# EAGLE design Apex3 (EAGLE 9.2.1)

## Sheet 1 of 3
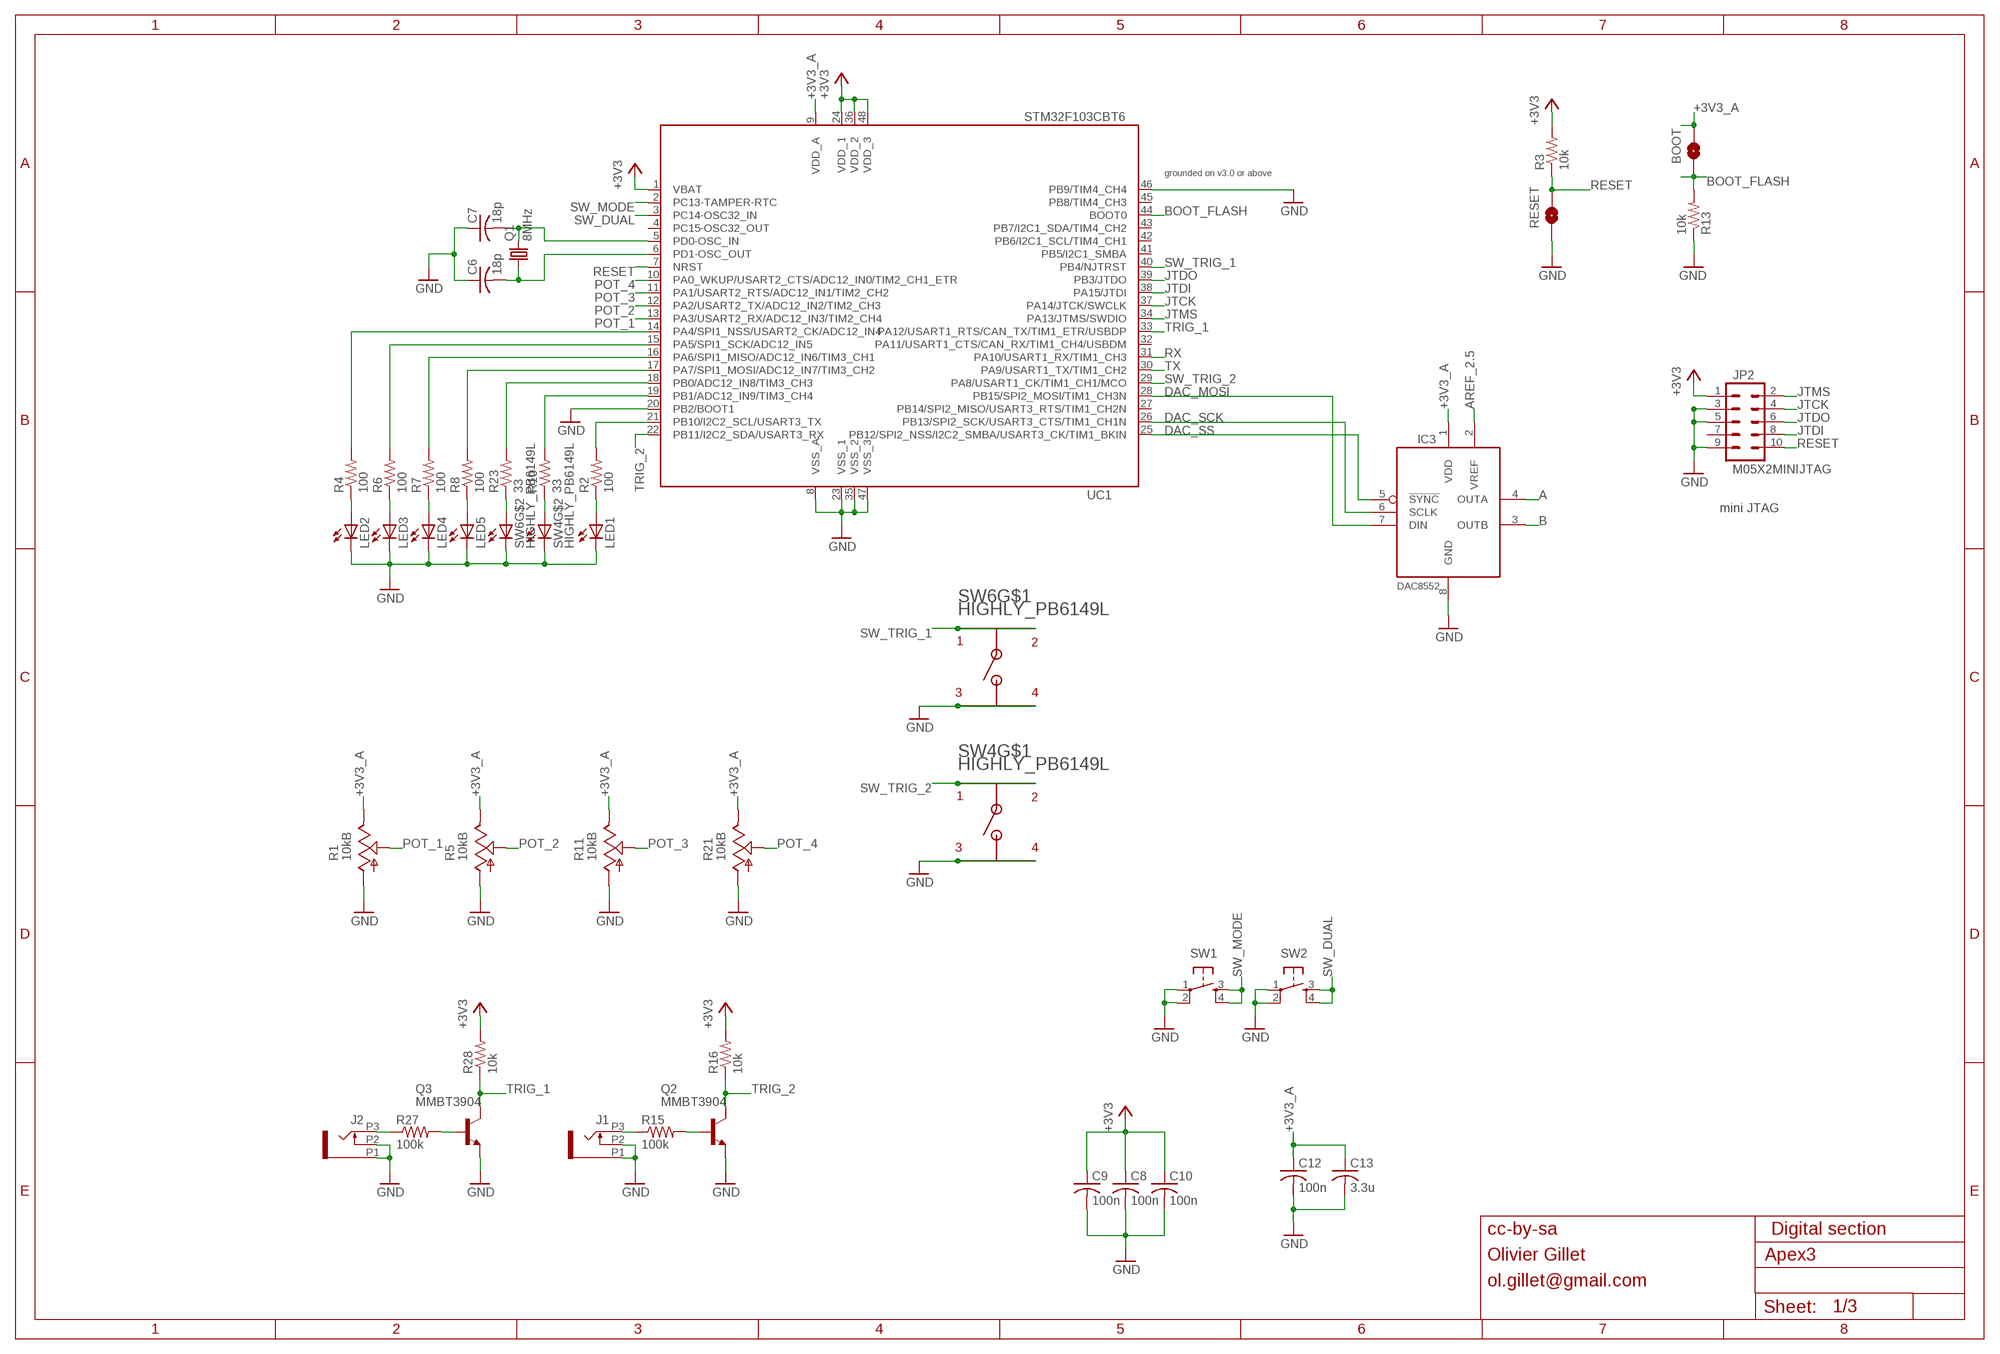
[diagram p0: schematic, sheet 1]

### Parts
BOOT  BOOT  JUMPER-SMT_2_NO_SILK  [SMT-JUMPER_2_NO_SILK]
C6  18p  C-USC0603  [C0603]
C7  18p  C-USC0603  [C0603]
C8  100n  C-USC0603  [C0603]
C9  100n  C-USC0603  [C0603]
C10  100n  C-USC0603  [C0603]
C12  100n  C-USC0603  [C0603]
C13  3.3u  C-USC0603  [C0603]
IC3  DAC8552  [MSOP-8]
J1  OG-PJ301_PJ301_THONKICONN  [OG-PJ301_WQP_PJ_301M6_NO_HOLE]
J2  OG-PJ301_PJ301_THONKICONN  [OG-PJ301_WQP_PJ_301M6_NO_HOLE]
JP2  M05X2MINIJTAG  [2X5-1.27]
LED1  LED3MM  [LED3MM]
LED2  LED3MM  [LED3MM]
LED3  LED3MM  [LED3MM]
LED4  LED3MM  [LED3MM]
LED5  LED3MM  [LED3MM]
Q1  8MHz  CRYSTALHC49UP  [HC49UP]
Q2  MMBT3904  MMBT3904LT1-NPN-SOT23-BEC  [SOT23-BEC]
Q3  MMBT3904  MMBT3904LT1-NPN-SOT23-BEC  [SOT23-BEC]
R1  10kB  POT-ALPS_POT_USVERTICAL  [POT-ALPS_ALPS_POT_VERTICAL]
R2  100  R-US_R0603  [R0603]
R3  10k  R-US_R0603  [R0603]
R4  100  R-US_R0603  [R0603]
R5  10kB  POT-ALPS_POT_USVERTICAL  [POT-ALPS_ALPS_POT_VERTICAL]
R6  100  R-US_R0603  [R0603]
R7  100  R-US_R0603  [R0603]
R8  100  R-US_R0603  [R0603]
R10  33  R-US_R0603  [R0603]
R11  10kB  POT-ALPS_POT_USVERTICAL  [POT-ALPS_ALPS_POT_VERTICAL]
R13  10k  R-US_R0603  [R0603]
R15  100k  R-US_R0603  [R0603]
R16  10k  R-US_R0603  [R0603]
R21  10kB  POT-ALPS_POT_USVERTICAL  [POT-ALPS_ALPS_POT_VERTICAL]
R23  33  R-US_R0603  [R0603]
R27  100k  R-US_R0603  [R0603]
R28  10k  R-US_R0603  [R0603]
RESET  RESET  JUMPER-SMT_2_NO_SILK  [SMT-JUMPER_2_NO_SILK]
SW1  TAC_SWITCHPTH  [TACTILE-PTH]
SW2  TAC_SWITCHPTH  [TACTILE-PTH]
SW4  HIGHLY_PB6149L  [HIGHLY_PB64149L]
SW6  HIGHLY_PB6149L  [HIGHLY_PB64149L]
UC1  STM32F103CBT6  STM32F103CB  [LQFP48]

### Nets
+3V3: C8.1 C9.1 C10.1 JP2.1 R3.2 R16.2 R28.2 UC1.1(VBAT) UC1.24(VDD_1) UC1.36(VDD_2) UC1.48(VDD_3) ; also sheet 3
+3V3_A: BOOT.2 C12.1 C13.1 IC3.1(VDD) R1.P$1(E) R5.P$1(E) R11.P$1(E) R21.P$1(E) UC1.9(VDD_A) ; also sheet 3
A: IC3.4(OUTA) ; also sheet 2
AREF_2.5: IC3.2(VREF) ; also sheet 3
B: IC3.3(OUTB) ; also sheet 2
BOOT_FLASH: BOOT.1 R13.2 UC1.44(BOOT0)
DAC_MOSI: IC3.7(DIN) UC1.28(PB15/SPI2_MOSI/TIM1_CH3N)
DAC_SCK: IC3.6(SCLK) UC1.26(PB13/SPI2_SCK/USART3_CTS/TIM1_CH1N)
DAC_SS: IC3.5(!SYNC) UC1.25(PB12/SPI2_NSS/I2C2_SMBA/USART3_CK/TIM1_BKIN)
GND: C6.1 C7.1 C8.2 C9.2 C10.2 C12.2 C13.2 IC3.8(GND) J1.P1 J1.P2 J2.P1 J2.P2 JP2.3 JP2.5 JP2.9 LED1.K(C) LED2.K(C) LED3.K(C) LED4.K(C) LED5.K(C) Q2.E Q3.E R1.P$3(A) R5.P$3(A) R11.P$3(A) R13.1 R21.P$3(A) RESET.1 SW1.1 SW1.2 SW2.1 SW2.2 SW4.L2 SW4.P$3 SW4.P$4 SW6.L2 SW6.P$3 SW6.P$4 UC1.8(VSS_A) UC1.20(PB2/BOOT1) UC1.23(VSS_1) UC1.35(VSS_2) UC1.46(PB9/TIM4_CH4) UC1.47(VSS_3) ; also sheet 2,3
JTCK: JP2.4 UC1.37(PA14/JTCK/SWCLK)
JTDI: JP2.8 UC1.38(PA15/JTDI)
JTDO: JP2.6 UC1.39(PB3/JTDO)
JTMS: JP2.2 UC1.34(PA13/JTMS/SWDIO)
N$1: J1.P3 R15.1
N$2: R23.2 UC1.18(PB0/ADC12_IN8/TIM3_CH3)
N$3: LED2.A R4.1
N$4: LED3.A R6.1
N$5: LED4.A R7.1
N$6: LED5.A R8.1
N$7: C7.2 Q1.2 UC1.5(PD0-OSC_IN)
N$8: C6.2 Q1.1 UC1.6(PD1-OSC_OUT)
N$9: R10.2 UC1.19(PB1/ADC12_IN9/TIM3_CH4)
N$10: R4.2 UC1.14(PA4/SPI1_NSS/USART2_CK/ADC12_IN4)
N$11: R6.2 UC1.15(PA5/SPI1_SCK/ADC12_IN5)
N$12: R7.2 UC1.16(PA6/SPI1_MISO/ADC12_IN6/TIM3_CH1)
N$13: R8.2 UC1.17(PA7/SPI1_MOSI/ADC12_IN7/TIM3_CH2)
N$14: Q2.B R15.2
N$16: R23.1 SW6.L1
N$17: R10.1 SW4.L1
N$18: LED1.A R2.1
N$19: R2.2 UC1.21(PB10/I2C2_SCL/USART3_TX)
N$57: J2.P3 R27.1
N$66: Q3.B R27.2
POT_1: R1.P$2(S) UC1.13(PA3/USART2_RX/ADC12_IN3/TIM2_CH4)
POT_2: R5.P$2(S) UC1.12(PA2/USART2_TX/ADC12_IN2/TIM2_CH3)
POT_3: R11.P$2(S) UC1.11(PA1/USART2_RTS/ADC12_IN1/TIM2_CH2)
POT_4: R21.P$2(S) UC1.10(PA0_WKUP/USART2_CTS/ADC12_IN0/TIM2_CH1_ETR)
RESET: JP2.10 R3.1 RESET.2 UC1.7(NRST)
RX: UC1.31(PA10/USART1_RX/TIM1_CH3)
SW_DUAL: SW2.3 SW2.4 UC1.3(PC14-OSC32_IN)
SW_MODE: SW1.3 SW1.4 UC1.2(PC13-TAMPER-RTC)
SW_TRIG_1: SW6.P$1 SW6.P$2 UC1.40(PB4/NJTRST)
SW_TRIG_2: SW4.P$1 SW4.P$2 UC1.29(PA8/USART1_CK/TIM1_CH1/MCO)
TRIG_1: Q3.C R28.1 UC1.33(PA12/USART1_RTS/CAN_TX/TIM1_ETR/USBDP)
TRIG_2: Q2.C R16.1 UC1.22(PB11/I2C2_SDA/USART3_RX)
TX: UC1.30(PA9/USART1_TX/TIM1_CH2)
Unconnected: JP2.7 UC1.4(PC15-OSC32_OUT) UC1.27(PB14/SPI2_MISO/USART3_RTS/TIM1_CH2N) UC1.32(PA11/USART1_CTS/CAN_RX/TIM1_CH4/USBDM) UC1.41(PB5/I2C1_SMBA) UC1.42(PB6/I2C1_SCL/TIM4_CH1) UC1.43(PB7/I2C1_SDA/TIM4_CH2) UC1.45(PB8/TIM4_CH3)

### Notes on the sheet
- grounded on v3.0 or above
- mini JTAG
- cc-by-sa | Digital section
- Olivier Gillet
- ol.gillet@gmail.com

## Sheet 2 of 3
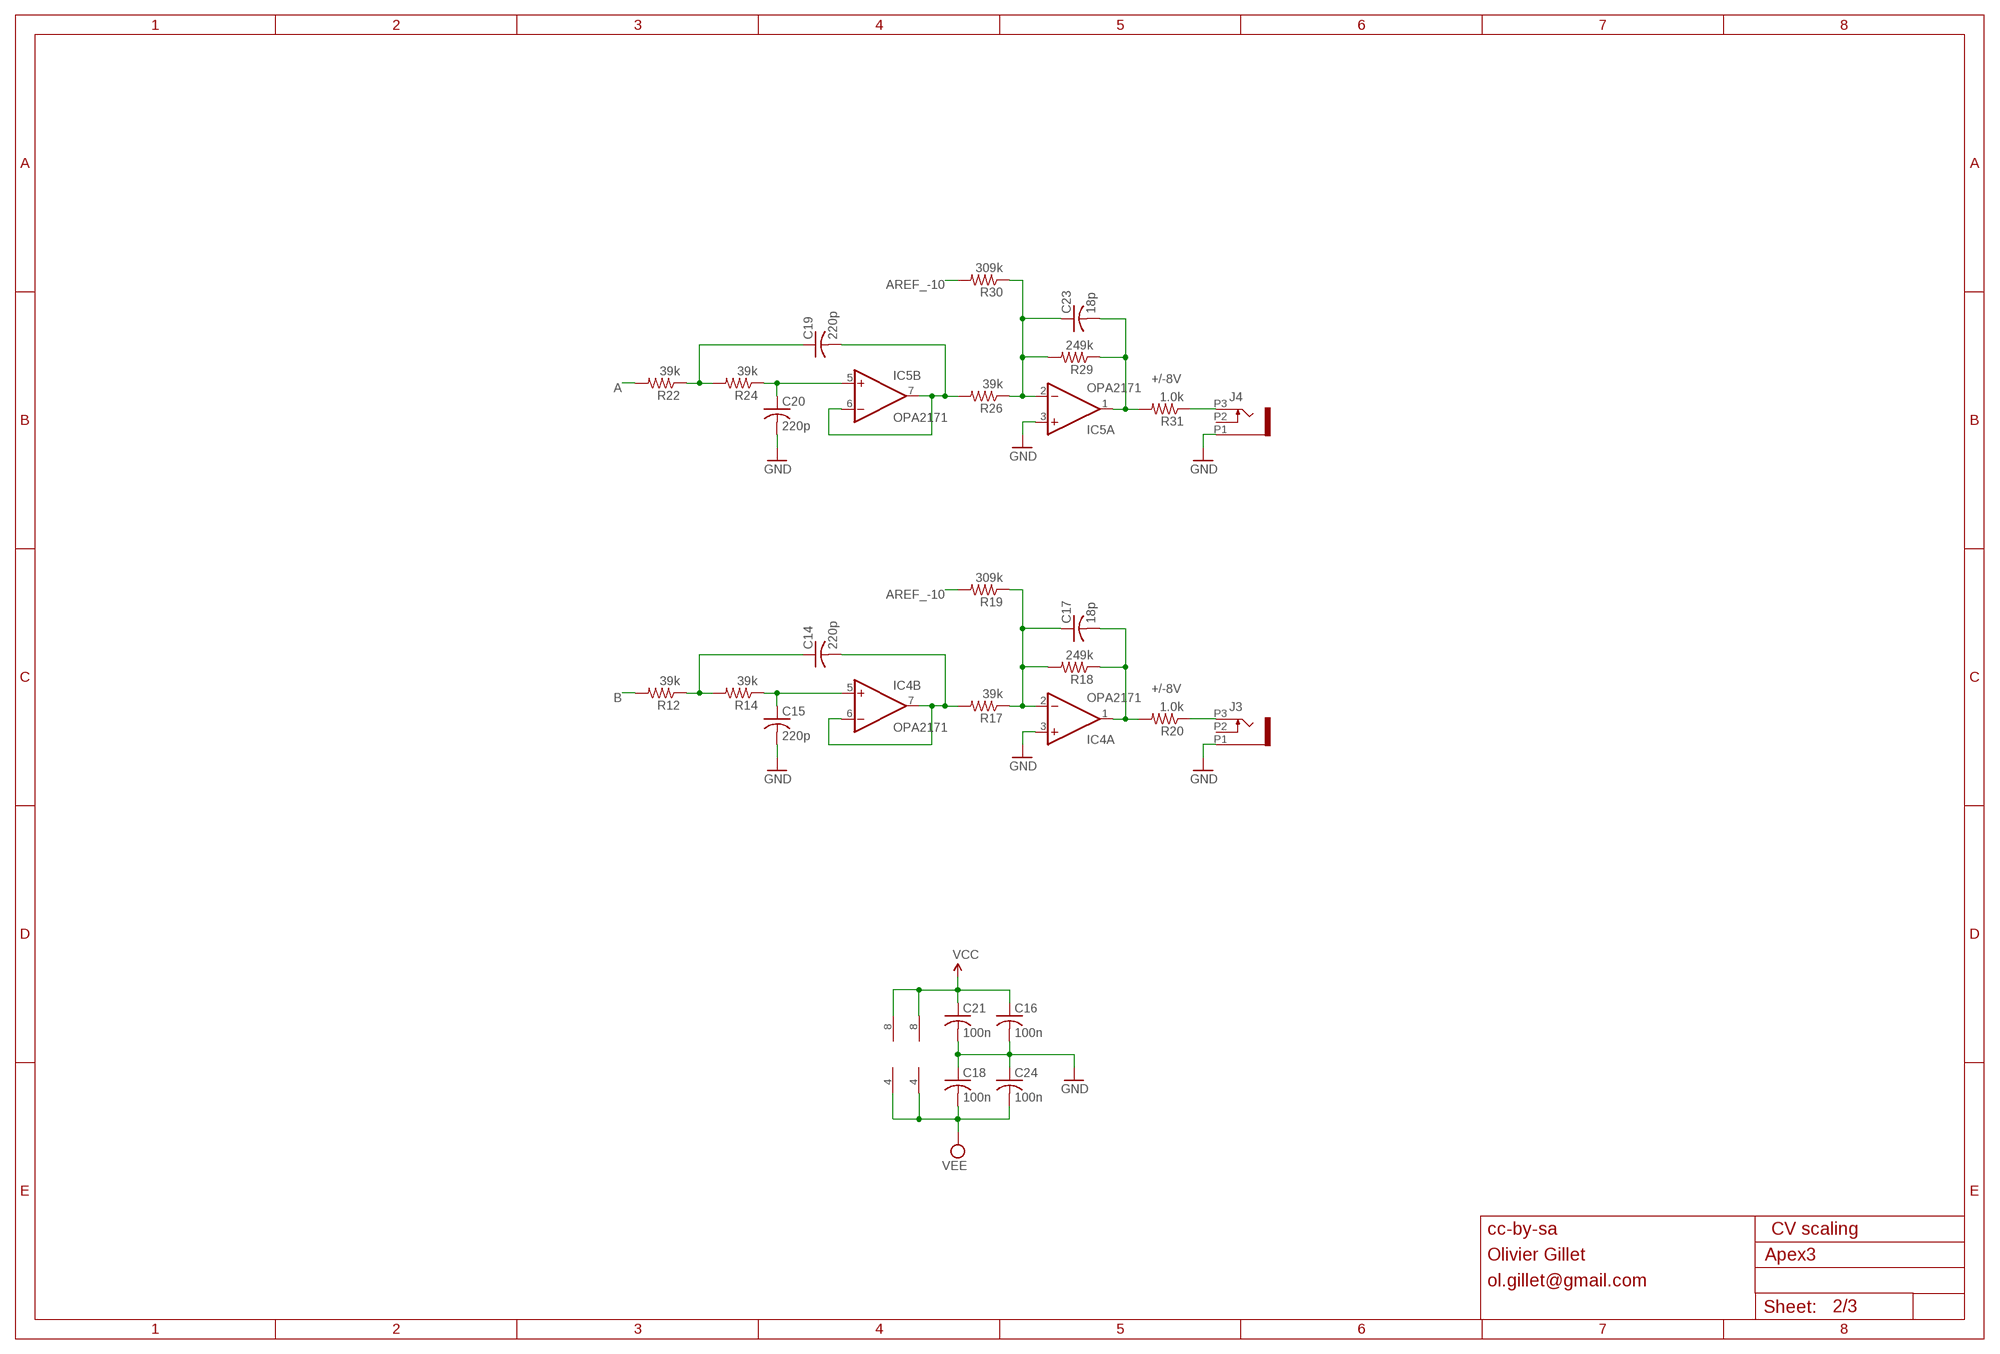
[diagram p1: schematic, sheet 2]

### Parts
C14  220p  C-USC0603  [C0603]
C15  220p  C-USC0603  [C0603]
C16  100n  C-USC0603  [C0603]
C17  18p  C-USC0603  [C0603]
C18  100n  C-USC0603  [C0603]
C19  220p  C-USC0603  [C0603]
C20  220p  C-USC0603  [C0603]
C21  100n  C-USC0603  [C0603]
C23  18p  C-USC0603  [C0603]
C24  100n  C-USC0603  [C0603]
IC4  OPA2171  TL072D  [SO08]
IC5  OPA2171  TL072D  [SO08]
J3  OG-PJ301_PJ301_THONKICONN  [OG-PJ301_WQP_PJ_301M6_NO_HOLE]
J4  OG-PJ301_PJ301_THONKICONN  [OG-PJ301_WQP_PJ_301M6_NO_HOLE]
R12  39k  R-US_R0603  [R0603]
R14  39k  R-US_R0603  [R0603]
R17  39k  R-US_R0603  [R0603]
R18  249k  R-US_R0603  [R0603]
R19  309k  R-US_R0603  [R0603]
R20  1.0k  R-US_R0603  [R0603]
R22  39k  R-US_R0603  [R0603]
R24  39k  R-US_R0603  [R0603]
R26  39k  R-US_R0603  [R0603]
R29  249k  R-US_R0603  [R0603]
R30  309k  R-US_R0603  [R0603]
R31  1.0k  R-US_R0603  [R0603]

### Nets
A: R22.2 ; also sheet 1
AREF_-10: R19.2 R30.2 ; also sheet 3
B: R12.2 ; also sheet 1
BI_OUT: C17.2 IC4.1(A:OUT) R18.1 R20.2
BI_OUT1: C23.2 IC5.1(A:OUT) R29.1 R31.2
F_CV: C17.1 IC4.2(A:-IN) R17.1 R18.2 R19.1
F_CV1: C23.1 IC5.2(A:-IN) R26.1 R29.2 R30.1
GND: C15.2 C16.2 C18.1 C20.2 C21.2 C24.1 IC4.3(A:+IN) IC5.3(A:+IN) J3.P1 J4.P1 ; also sheet 1,3
N$15: C19.2 IC5.6(B:-IN) IC5.7(B:OUT) R26.2
N$20: C20.1 IC5.5(B:+IN) R24.1
N$21: C19.1 R22.1 R24.2
N$22: J3.P3 R20.1
N$24: J4.P3 R31.1
N$42: C14.2 IC4.6(B:-IN) IC4.7(B:OUT) R17.2
N$43: C15.1 IC4.5(B:+IN) R14.1
N$45: C14.1 R12.1 R14.2
VCC: C16.1 C21.1 IC4.8(P:V+) IC5.8(P:V+) ; also sheet 3
VEE: C18.2 C24.2 IC4.4(P:V-) IC5.4(P:V-) ; also sheet 3
Unconnected: J3.P2 J4.P2

### Notes on the sheet
- +/-8V
- +/-8V
- cc-by-sa | CV scaling
- Olivier Gillet
- ol.gillet@gmail.com

## Sheet 3 of 3
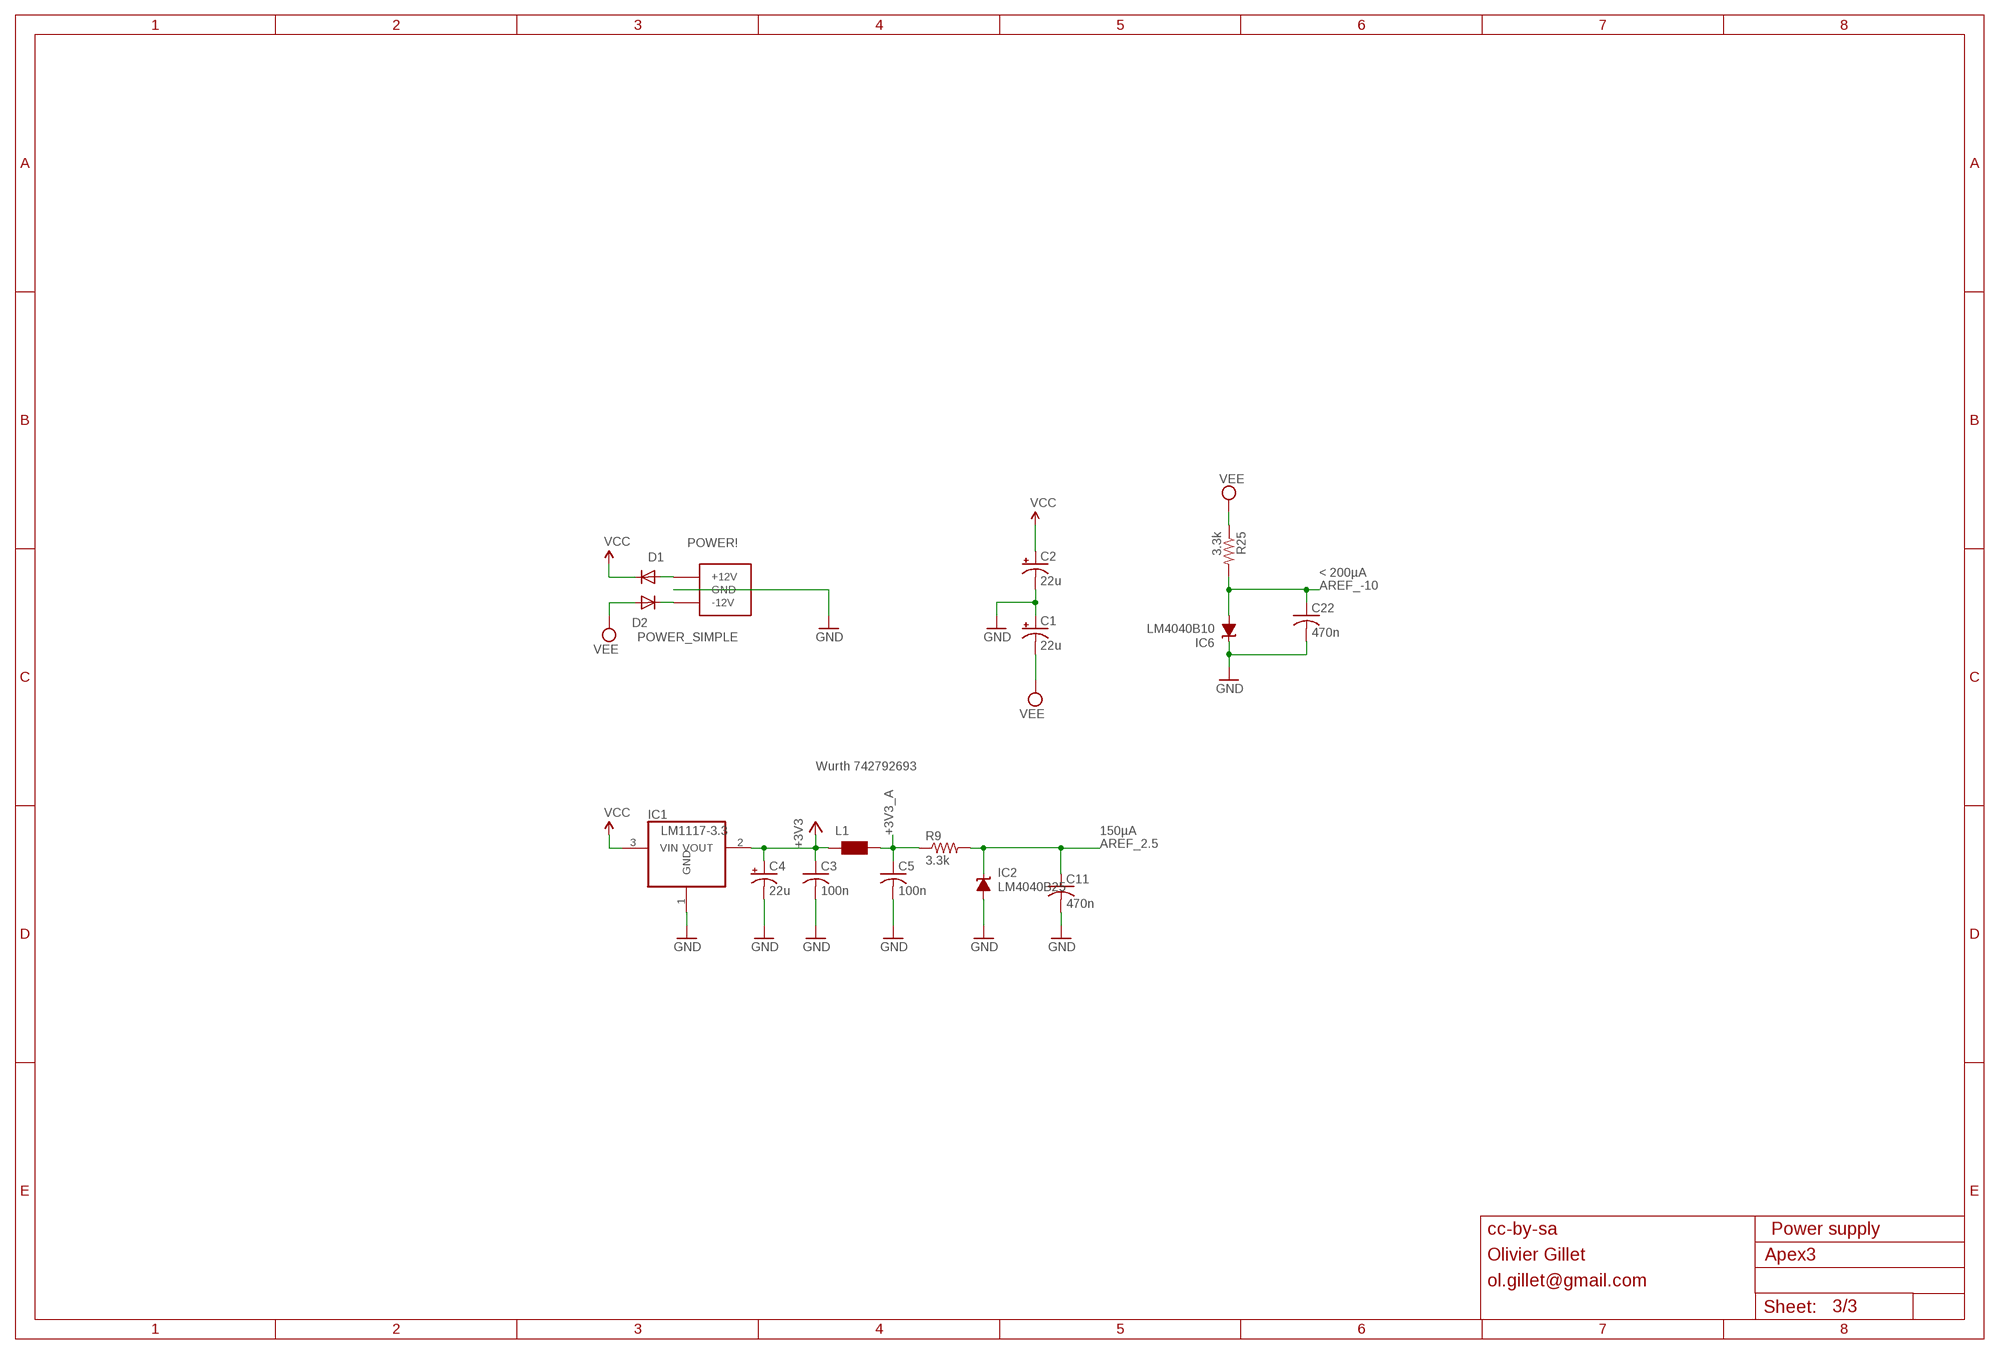
[diagram p2: schematic, sheet 3]

### Parts
C1  22u  CPOL-USC  [PANASONIC_C]
C2  22u  CPOL-USC  [PANASONIC_C]
C3  100n  C-USC0603  [C0603]
C4  22u  CPOL-USC  [PANASONIC_C]
C5  100n  C-USC0603  [C0603]
C11  470n  C-USC0603  [C0603]
C22  470n  C-USC0603  [C0603]
D1  1N5819HW  DIODE-SOD123  [SOD123]
D2  1N5819HW  DIODE-SOD123  [SOD123]
IC1  LM1117-3.3  REG1117  [SOT223]
IC2  LM4040B25  LM4041B12DBZ  [DBZ_R-PDSO-G3]
IC6  LM4040B10  LM4041B12DBZ  [DBZ_R-PDSO-G3]
L1  WE-CBF_0603  [0603]
POWER!  POWER_SIMPLE  [2X05_SMT_HEADER]
R9  3.3k  R-US_R0603  [R0603]
R25  3.3k  R-US_R0603  [R0603]

### Nets
+3V3: C3.1 C4.+ IC1.2(VOUT) L1.1 ; also sheet 1
+3V3_A: C5.1 L1.2 R9.1 ; also sheet 1
AREF_2.5: C11.1 IC2.1(C) R9.2 ; also sheet 1
AREF_-10: C22.1 IC6.2(A) R25.2 ; also sheet 2
GND: C1.+ C2.- C3.2 C4.- C5.2 C11.2 C22.2 IC1.1(GND) IC2.2(A) IC6.1(C) POWER!.3(GND) POWER!.4(GND) POWER!.5(GND) POWER!.6(GND) POWER!.7(GND) POWER!.8(GND) ; also sheet 1,2
N$23: D1.A POWER!.9(+12V) POWER!.10(+12V)
N$25: D2.C POWER!.1(-12V) POWER!.2(-12V)
VCC: C2.+ D1.C IC1.3(VIN) ; also sheet 2
VEE: C1.- D2.A R25.1 ; also sheet 2

### Notes on the sheet
- < 200µA
- Wurth 742792693
- 150µA
- cc-by-sa | Power supply
- Olivier Gillet
- ol.gillet@gmail.com

## Library data of the parts
BOOT RESET = SparkFun-Jumpers:JUMPER-SMT_2_NO: Normally open jumper This jumper has two pads in close proximity to each other. Apply solder to close the connection. Round pads are easier to solder for beginners, but are a lot larger. SparkFun Product that uses the round pads: SparkFun EL Sequencer <https://www.sparkfun.com/products/12781>
C1 C2 C4 = rcl:CPOL-US: POLARIZED CAPACITOR, American symbol
C3 C5-C24 = rcl:C-US: CAPACITOR, American symbol
D1 D2 = diode:DIODE-: DIODE
IC1 = og-vreg:REG1117: 800mA and 1A Low Dropout (LDO) Positive Regulator 1.8V, 2.5V, 2.85V, 3.3V, 5V, and Adj
IC2 IC6 = texas:LM4041: PRECISION MICROPOWER SHUNT VOLTAGE REFERENCE Source: http://focus.ti.com/lit/ds/slcs146e/slcs146e.pdf
IC3 = og-dac:DAC8552
IC4 IC5 = linear:TL072: OP AMP
J1-J4 = SHAY_THONKICONNS:OG-PJ301_PJ301_THONKICONN
JP2 = og-header:M05X2: Header 5x2 Standard 10-pin dual row 0.1" header. Commonly used with AVR-ISP. Use with Spark Fun Electronics SKU: PRT-00778
L1 = wuerth-elektronik:WE-CBF: SMD EMI Suppression Ferrite Beads - excellent anti-EMI properties - low DCR - impedances till 3000 ohms - rated current up to 6 A
LED1-LED5 = led:LED: LED OSRAM: - CHIPLED LG R971, LG N971, LY N971, LG Q971, LY Q971, LO R971, LY R971 LH N974, LH R974 LS Q976, LO Q976, LY Q976 LO Q996 - Hyper CHIPLED LW Q18S LB Q993, LB Q99A, LB R99A - SideLED LS A670, LO A670, LY A670, LG A670, LP A670 LB A673, LV A673, LT A673, LW A673 LH A674 LY A675 LS A676, LA A676, LO A676, LY A676, LW A676 LS A679, LY A679, LG A679 - Hyper Micro SIDELED® LS Y876, LA Y876, LO Y876, LY Y876 LT Y87S - SmartLED LW L88C, LW L88S LB L89C, LB L89S, LG L890 LS L89K, LO L89K, LY L89K LS L896, LA L896, LO L896, LY L896 - TOPLED LS T670, LO T670, LY T670, LG T670, LP T670 LSG T670, LSP T670, LSY T670, LOP T670, LYG T670 LG T671, LOG T671, LSG T671 LB T673, LV T673, LT T673, LW T673 LH T674 LS T676, LA T676, LO T676, LY T676, LB T676, LH T676, LSB T676, LW T676 LB T67C, LV T67C, LT T67C, LS T67K, LO T67K, LY T67K, LW E67C LS E67B, LA E67B, LO E67B, LY E67B, LB E67C, LV E67C, LT E67C LW T67C LS T679, LY T679, LG T679 LS T770, LO T770, LY T770, LG T770, LP T770 LB T773, LV T773, LT T773, LW T773 LH T774 LS E675, LA E675, LY E675, LS T675 LS T776, LA T776, LO T776, LY T776, LB T776 LHGB T686 LT T68C, LB T68C - Hyper Mini TOPLED® LB M676 - Mini TOPLED Santana® LG M470 LS M47K, LO M47K, LY M47K Source: http://www.osram.convergy.de LUXEON: - LUMILED® LXK2-PW12-R00, LXK2-PW12-S00, LXK2-PW14-U00, LXK2-PW14-V00 LXK2-PM12-R00, LXK2-PM12-S00, LXK2-PM14-U00 LXK2-PE12-Q00, LXK2-PE12-R00, LXK2-PE12-S00, LXK2-PE14-T00, LXK2-PE14-U00 LXK2-PB12-K00, LXK2-PB12-L00, LXK2-PB12-M00, LXK2-PB14-N00, LXK2-PB14-P00, LXK2-PB14-Q00 LXK2-PR12-L00, LXK2-PR12-M00, LXK2-PR14-Q00, LXK2-PR14-R00 LXK2-PD12-Q00, LXK2-PD12-R00, LXK2-PD12-S00 LXK2-PH12-R00, LXK2-PH12-S00 LXK2-PL12-P00, LXK2-PL12-Q00, LXK2-PL12-R00 Source: www.luxeon.com KINGBRIGHT: KA-3528ASYC Source: www.kingbright.com
POWER! = EurorackModularParts:POWER_SIMPLE
Q1 = crystal:CRYSTAL: CRYSTAL
Q2 Q3 = transistor:*-NPN-: NPN Transistror BF959 corrected 2008.03.06
R1 R5 R11 R21 = braids_v50:POT-ALPS_POT_US
R2-R4 R6-R10 R12-R20 R22-R31 = rcl:R-US_: RESISTOR, American symbol
SW1 SW2 = SparkFun:TAC_SWITCH: Momentary Switch Button commonly used for reset or general input. Spark Fun Electronics SKU : COM-00097
SW4 SW6 = HIGHLY PB6149L:HIGHLY_PB6149L
UC1 = stm32:STM32F103CB

## Board
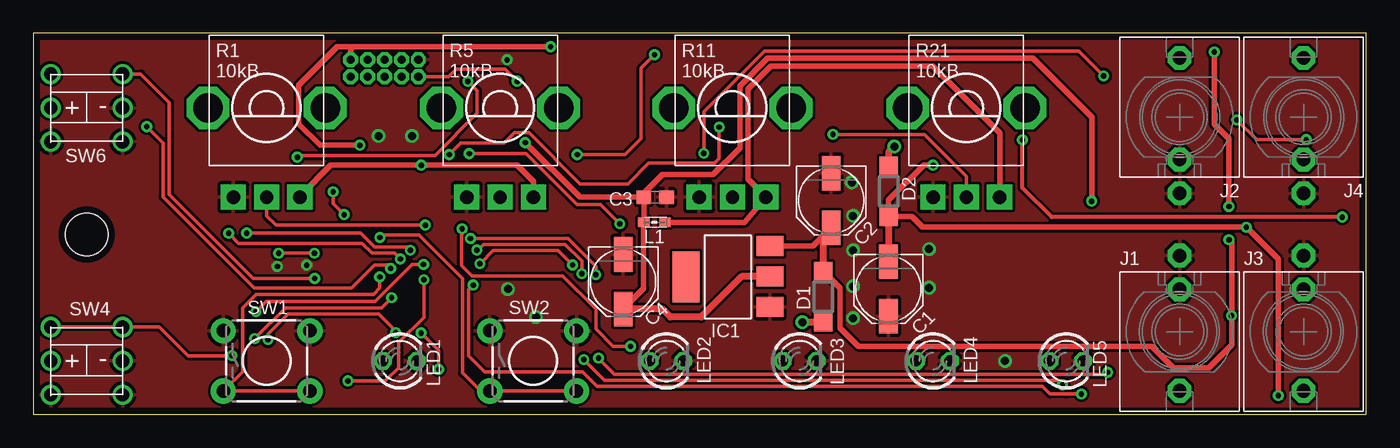
[diagram p3: board, top side]
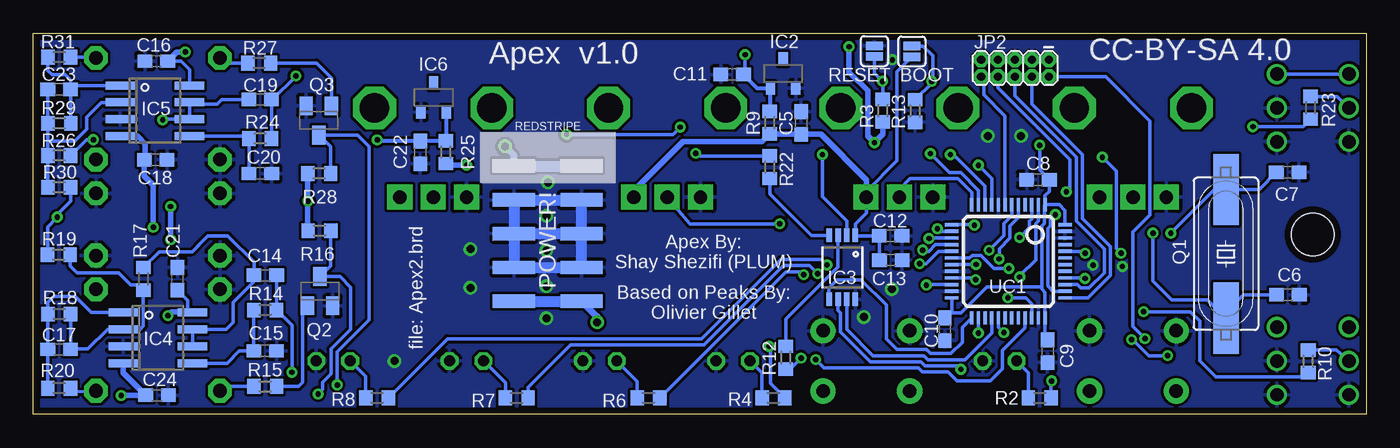
[diagram p4: board, bottom side, seen from below]

Size 100 x 28.6 mm. Coordinates in mm from the lower left corner, seen from the top.
Outline: 0,0 100,0 100,28.6 0,28.6 0,0
Copper layers (1*16): Top 0.035mm / dielectric 1.5mm / Bottom 0.035mm
Design rules "default *": minimum track width 8mil, minimum drill 0.4mm, track to track 8mil, track to pad 6mil, pad to pad 6mil, via to via 6mil, smd to smd 6mil, copper to edge 20mil, drill to drill 6mil, minimum pad ring 10mil, minimum via ring 8mil, stop-mask expansion 4mil, vias tented up to drill 25mil, thermal gap 10mil
Holes 3.2 mm at 4,13.5

### Footprints (pad centres in the part's own frame; a part is rotated, then mirrored left to right if it is on the bottom)
SMT-JUMPER_2_NO_SILK = smd 0.635 x 1.27: 1 -0.406,0; 2 0.406,0
PANASONIC_C = smd 2.6 x 1.4: + 2.05,0; - -2.05,0
C0603 = smd 1.1 x 1: 1 -0.85,0; 2 0.85,0
SOD123 = smd 1.4 x 1.4: A 1.9,0; C -1.9,0
SOT223 = smd 1.499 x 2.007: 1 -2.261,-3.15; 2 0.025,-3.15; 3 2.311,-3.15 | smd 3.81 x 2.007: 4 0,3.15
DBZ_R-PDSO-G3 = smd 0.7 x 1: 1 -0.95,-1.1; 2 0.95,-1.1; 3 0,1.1
MSOP-8 = smd 0.41 x 1.02: 1 -0.975,-2.4; 2 -0.325,-2.4; 3 0.325,-2.4; 4 0.975,-2.4; 5 0.975,2.4; 6 0.325,2.4; 7 -0.325,2.4; 8 -0.975,2.4
SO08 = smd 0.6 x 2.2: 1 -1.905,-2.6; 2 -0.635,-2.6; 3 0.635,-2.6; 4 1.905,-2.6; 5 1.905,2.6; 6 0.635,2.6; 7 -0.635,2.6; 8 -1.905,2.6
OG-PJ301_WQP_PJ_301M6_NO_HOLE = drill 1.016 pad 1.778 octagon: P1 0,-5.715; P2 0,-3.175; P3 0,4.445
2X5-1.27 = drill 0.61 pad 1.067 octagon: 1 -1.27,3.81; 2 0,3.81; 3 -1.27,2.54; 4 0,2.54; 5 -1.27,1.27; 6 0,1.27; 7 -1.27,0; 8 0,0; 9 -1.27,-1.27; 10 0,-1.27
0603 = smd 0.85 x 0.7: 1 -0.9,0; 2 0.7,0
LED3MM = drill 0.813 octagon: A -1.27,0; K 1.27,0
2X05_SMT_HEADER = smd 1 x 3.17: 1 -5.08,-2.54; 2 -5.08,2.54; 3 -2.54,-2.54; 4 -2.54,2.54; 5 0,-2.54; 6 0,2.54; 7 2.54,-2.54; 8 2.54,2.54; 9 5.08,-2.54; 10 5.08,2.54
HC49UP = smd 5.334 x 1.93: 1 -4.826,0; 2 4.826,0
SOT23-BEC = smd 1 x 1.4: B -0.95,-1.1; C 0,1.1; E 0.95,-1.1
POT-ALPS_ALPS_POT_VERTICAL = drill 1 pad 1.88 square: P$1 -2.5,6.7; P$2 0,6.7; P$3 2.5,6.7 | drill 2.2 pad 3.175 octagon: P$4 -4.4,0; P$5 4.4,0
R0603 = smd 1 x 1.1: 1 -0.85,0; 2 0.85,0
TACTILE-PTH = drill 1.016 pad 1.88: 1 -3.251,2.261; 2 3.251,2.261; 3 -3.251,-2.261; 4 3.251,-2.261
HIGHLY_PB64149L = drill 1: L1 0,-2.7; L2 0,2.7; P$1 -2.54,-2.7; P$2 -2.54,2.7; P$3 2.54,-2.7; P$4 2.54,2.7
LQFP48 = smd 0.254 x 1: 1 -2.75,-4.25; 2 -2.25,-4.25; 3 -1.75,-4.25; 4 -1.25,-4.25; 5 -0.75,-4.25; 6 -0.25,-4.25; 7 0.25,-4.25; 8 0.75,-4.25; 9 1.25,-4.25; 10 1.75,-4.25; 11 2.25,-4.25; 12 2.75,-4.25; 25 2.75,4.25; 26 2.25,4.25; 27 1.75,4.25; 28 1.25,4.25; 29 0.75,4.25; 30 0.25,4.25; 31 -0.25,4.25; 32 -0.75,4.25; 33 -1.25,4.25; 34 -1.75,4.25; 35 -2.25,4.25; 36 -2.75,4.25 | smd 1 x 0.254: 13 4.25,-2.75; 14 4.25,-2.25; 15 4.25,-1.75; 16 4.25,-1.25; 17 4.25,-0.75; 18 4.25,-0.25; 19 4.25,0.25; 20 4.25,0.75; 21 4.25,1.25; 22 4.25,1.75; 23 4.25,2.25; 24 4.25,2.75; 37 -4.25,2.75; 38 -4.25,2.25; 39 -4.25,1.75; 40 -4.25,1.25; 41 -4.25,0.75; 42 -4.25,0.25; 43 -4.25,-0.25; 44 -4.25,-0.75; 45 -4.25,-1.25; 46 -4.25,-1.75; 47 -4.25,-2.25; 48 -4.25,-2.75

### Placement (x,y rotation side)
BOOT  34.09,27.24 270 bottom
C1  64.15,9.41 270 top
C2  59.86,16.05 270 top
C3  46.66,16.29 0 top
C4  44.25,9.95 270 top
C5  42.39,21.87 90 bottom
C6  5.87,8.97 180 bottom
C7  5.89,18.17 180 bottom
C8  24.62,17.61 180 bottom
C9  23.91,4.73 270 bottom
C10  31.61,6.38 270 bottom
C11  47.57,25.51 180 bottom
C12  35.68,13.39 0 bottom
C13  35.67,11.57 0 bottom
C14  82.59,10.43 180 bottom
C15  82.61,4.76 0 bottom
C16  90.77,26.51 180 bottom
C17  98.07,4.87 180 bottom
C18  90.82,19.11 180 bottom
C19  82.98,23.63 180 bottom
C20  82.97,18.07 0 bottom
C21  89.18,10.17 90 bottom
C22  70.97,19.66 270 bottom
C23  98.07,24.39 0 bottom
C24  90.72,1.43 180 bottom
D1  59.27,8.83 270 top
D2  64.17,16.73 270 top
IC1  52.11,10.31 90 top
IC2  43.74,25.58 0 bottom
IC3  39.3,11.03 180 bottom
IC4  90.65,5.74 270 bottom
IC5  90.88,22.78 270 bottom
IC6  69.97,23.78 0 bottom
J1  86,6.2 180 top
J2  86,22.3 0 top
J3  95.3,6.2 180 top
J4  95.3,22.3 0 top
JP2  27.62,25.35 270 bottom
L1  46.69,14.41 0 top
LED1  27.5,4 0 top
LED2  47.5,4 0 top
LED3  57.5,4 0 top
LED4  67.5,4 0 top
LED5  77.5,4 0 top
POWER!  61.41,13.56 270 bottom
Q1  10.52,12.04 90 bottom
Q2  78.49,9.24 0 bottom
Q3  78.58,22.06 180 bottom
R1  17.5,23 180 top
R2  24.49,1.23 0 bottom
R3  36.27,22.79 270 bottom
R4  44.47,1.23 0 bottom
R5  35.02,23 180 top
R6  53.85,1.23 0 bottom
R7  63.73,1.23 0 bottom
R8  74.21,1.23 0 bottom
R9  44.75,21.89 90 bottom
R10  4.35,3.97 270 bottom
R11  52.45,23 180 top
R12  43.55,4.25 90 bottom
R13  33.85,22.77 90 bottom
R14  82.61,7.82 0 bottom
R15  82.59,2.09 0 bottom
R16  78.53,13.78 180 bottom
R17  91.75,10.17 90 bottom
R18  98.06,7.52 0 bottom
R19  98.08,11.97 180 bottom
R20  98.07,1.95 180 bottom
R21  70,23 180 top
R22  44.75,18.55 270 bottom
R23  4.17,23.01 270 bottom
R24  82.98,20.7 0 bottom
R25  69.05,19.67 90 bottom
R26  98.05,19.42 0 bottom
R27  83.05,26.36 0 bottom
R28  78.55,18.07 180 bottom
R29  98.04,21.83 180 bottom
R30  98.06,17.04 0 bottom
R31  98.06,26.81 180 bottom
RESET  36.9,27.26 270 bottom
SW1  17.5,4 0 top
SW2  37.5,4 0 top
SW4  4,4 270 top
SW6  4,23 270 top
UC1  26.84,11.48 180 bottom

### Tracks (layer width: path | path; a pad name or v marks a point on that pad's centre or on a via)
+3V3  (via drill 0.4)
  Top 0.254: JP2.1
  Top 0.305: L1.1 45.81,14.43
  Top 0.406: C4.+ 45.79,9.44 L1.1 | 45.81,14.43 C3.1 | C3.1 41.01,16.29 v36.9,20.4 | C3.1 45.81,16.61 47.2,18 51.01,18 53,19.99 53,24.65 55.08,26.72 75,26.72 79.4,22.32 v79.4,16 | 24,27.6 23.8,27.4 JP2.1 | v38.8,27.6 24,27.6 | v24.5,20.2 21.5,20.2 19.9,21.8 19.9,24.7 22.8,27.6 24,27.6
  Top 0.508: IC1.2 53.13,10.34 50.1,7.3 47.8,7.3 47.2,7.9 C4.+
  Bottom 0.254: 79.38,18.05 R28.2 | C9.1 24.09,5.76 UC1.36 24.09,9.15 24.34,9.4 24.34,9.5 | UC1.24 31.09,7.75 C10.1 31.24,7.6 30.4,7.6 28.45,9.55 24.8,9.55 | UC1.48 22.59,15.29 23.03,15.73 UC1.1 | UC1.1 24.09,16.41 23.77,16.73 C8.1 24.5,18.34 v24.5,20.2 | UC1.1 24.13,15.69 24.13,14.33 24.34,14.12 24.34,9.5 | 24.8,9.55 | 24.8,9.55 24.39,9.55 24.34,9.5
  Bottom 0.406: 79.38,18.05 79.4,18.03 v79.4,16 79.4,13.8 R16.2 | R3.2 36.27,21.03 v36.9,20.4 37.4,20.9 37.4,24.3 38.8,25.7 v38.8,27.6
+3V3_A  (via drill 0.4)
  Top 0.406: L1.2 53.36,14.41 R11.P$1 53.61,17.64 53.61,24.39 55.33,26.11 67.5,26.11 72.5,21.11 R21.P$1 | R1.P$1 20,16.4 22.3,18.7 v29.1,18.7 36.3,18.7 37.52,17.48 R5.P$1
  Bottom 0.254: BOOT.2 35.2,25.72 35.2,19.04 37.5,16.73 37.5,16.32 37.5,15.1 38.33,14.28 IC3.1 38.28,13.39 C12.1 C13.1 | UC1.9 28.09,17.69 v29.1,18.7
  Bottom 0.305: 42.41,21.04 C5.1
  Bottom 0.406: 42.41,21.04 R9.1 45.32,20.47 51.27,20.47 54.95,16.79 R11.P$1 | C5.1 40.92,21.02 37.5,17.6 37.5,16.32 R5.P$1
A
  Bottom 0.254: IC3.4 41.63,13.43 44.75,16.55 R22.2
AREF_2.5  (via drill 0.4)
  Top 0.254: v40.8,19.5 44.4,19.5 45.6,20.7 45.6,26 v46.6,27
  Bottom 0.254: v40.8,19.5 40.8,16.35 38.98,14.52 IC3.2 | v46.6,27 46.6,25.6 46.7,25.5
  Bottom 0.305: C11.1 46.7,25.5 45.69,24.48 IC2.1 | IC2.1 | R9.2 44.7,22.79 IC2.1
AREF_-10  (via drill 0.4)
  Top 0.305: v74.2,20.6 74.2,17 76.4,14.8 v98.2,14.8
  Bottom 0.254: R30.2 97.21,15.99 98.2,15 v98.2,14.8 98.93,14.07 R19.2
  Bottom 0.305: C22.1 71.2,20.51 | 71.2,20.51 74.11,20.51 v74.2,20.6 | IC6.2 69.02,20.55 R25.2 71.19,20.52 71.2,20.51
B
  Bottom 0.254: IC3.3 39.62,11.07 43.55,7.15 R12.2
BI_OUT
  Bottom 0.254: C17.2 | 98.91,5 98.91,6 R18.1 98.91,8.39 98.45,8.85 96.85,8.85 95.64,7.64 IC4.1 | 98.91,5 C17.2 | R20.2 98.92,4.99 98.91,5
BI_OUT1
  Bottom 0.254: 97.19,24.36 C23.2 96.92,24.68 IC5.1 | R31.2 98.91,25.81 98.6,25.5 97.6,25.5 97.19,25.09 97.19,24.36 | R29.1 97.19,24.36
BOOT_FLASH  (via drill 0.4)
  Top 0.254: v21.09,12.1 v18.4,12.1 | v19.8,19.3 19.93,19.43 30.13,19.43 33.3,22.6 33.3,24.3 v32.6,25
  Bottom 0.254: BOOT.1 33.24,27.65 32.5,26.91 32.5,25.1 v32.6,25 32.6,24.87 R13.2 33.85,23.36 | UC1.44 21.23,12.23 v21.09,12.1 | v19.8,19.3 18.74,18.24 18.74,12.44 v18.4,12.1
DAC_MOSI
  Bottom 0.254: IC3.7 38.98,6.38 37,4.4 33.2,4.4 32.9,4.1 30.1,4.1 28.1,6.1 UC1.28
DAC_SCK  (via drill 0.4)
  Top 0.254: v29.09,6.1 30.4,4.79 v30.4,3.37
  Bottom 0.254: IC3.6 39.62,7.8 39.43,7.61 39.43,6.19 37.19,3.94 33.39,3.94 33.09,3.64 30.68,3.64 v30.4,3.37 | UC1.26 v29.09,6.1
DAC_SS
  Bottom 0.254: IC3.5 40.3,8.65 40.3,9.5 39.7,10.1 37.9,10.1 36,8.2 36,5.66 35.2,4.86 33.01,4.86 32.98,4.83 32.97,4.83 32.7,4.56 31.14,4.56 30.3,5.39 30.3,6.52 UC1.25
F_CV
  Bottom 0.254: C17.1 97.19,4.9 | 97.19,4.9 97.1,4.99 | 97.1,4.9 95.9,4.9 94.42,6.38 IC4.2 92,6.38 91.75,6.62 R17.1 92.13,9.7 92.7,9.7 93.6,10.6 96.7,10.6 97.23,11.13 R19.1 | 97.1,4.9 97.19,4.9 | R18.2 97.21,5.01 97.1,4.9
F_CV1
  Bottom 0.254: 98.92,21.86 R29.2 | R29.2 98.89,22.1 98.75,22.1 | R26.1 98.75,19.57 | R30.1 R26.1 | 94.48,23.41 IC5.2 93.5,23.4 94.9,23.4 96,22.3 96,21.4 96.9,20.5 98.8,20.5 98.9,20.6 | C23.1 98.92,21.86 | 98.92,21.86 R29.2 | R26.1 98.9,20.6 | 98.9,20.6 R29.2 98.92,21.86
GND  (via drill 0.4, 0.6)
  Bottom 0.813: POWER!.5 POWER!.6 | POWER!.6 POWER!.8 POWER!.7 POWER!.5 | POWER!.6 POWER!.4 POWER!.3 POWER!.5
  other vias: 61.5,7.2 61.5,9.6 61.5,12.3 61.5,14.9 61.4,17.4 35.6,9.4 37.7,7.3 25.9,20.9 28.4,20.9 20.5,11.2 18.3,11.1 35.54,26.61 67.2,12.4 67.2,9.5 72.9,4
  pour Top: 100.2,28.9 -0.3,28.9 -0.3,24.5 -0.3,-0.2 5.3,-0.2 100.2,-0.2
  pour Bottom: 100.2,28.9 -0.3,28.9 -0.3,24.5 -0.3,-0.2 5.3,-0.2 100.2,-0.2
JTCK
  Bottom 0.254: JP2.4 25.08,23.28 21.3,19.5 21.3,14.7 19.2,12.6 19.2,10.42 20.89,8.73 UC1.37
JTDI  (via drill 0.4)
  Top 0.254: v22.49,16.7 22.49,15.82 v23.32,14.99
  Bottom 0.254: 22.21,16.98 22.21,16.9 22.41,16.7 v22.49,16.7 22.21,16.98 | JP2.8 27.62,24.53 22.21,19.12 22.21,16.98 | UC1.38 23.5,9.23 23.89,9.62 23.89,13.93 23.68,14.14 23.68,14.63 v23.32,14.99
JTDO
  Bottom 0.254: JP2.6 26.35,23.9 21.76,19.31 21.76,14.51 19.66,12.41 19.66,10.61 20.8,9.47 21.4,9.47 21.67,9.73 UC1.39
JTMS  (via drill 0.4)
  Top 0.254: v26.88,8.74 26.14,8 18.92,8 v16.6,5.68
  Bottom 0.254: JP2.2 19.55,25.35 16.22,22.02 16.22,14.94 17.5,13.66 17.5,6.58 v16.6,5.68 | 26.88,8.8 v26.88,8.74 25.54,8.74 25.09,8.29 UC1.34
N$1
  Bottom 0.254: R15.1 85.83,2.09 J1.P3
N$2  (via drill 0.4)
  Top 0.254: v26.81,10.95 26.56,11.2 25.6,11.2 23.87,9.47 16.59,9.47 9.74,16.31 9.74,20.36 v8.5,21.6
  Bottom 0.254: UC1.18 29.75,11.73 29.56,11.93 28.9,11.93 27.92,10.95 v26.81,10.95 | v8.5,21.6 4.73,21.6 R23.2
N$3
  Bottom 0.254: LED2.A 45.32,3.09 R4.1
N$4
  Bottom 0.254: LED3.A 54.7,2.47 R6.1
N$5
  Bottom 0.254: LED4.A 64.58,2.35 R7.1
N$6
  Bottom 0.254: LED5.A 75.06,2.83 R8.1
N$7  (via drill 0.4)
  Top 0.254: 27.5,11.69 v27.53,11.66 27.09,12.1 25.41,12.1 24.67,12.83 15.42,12.83 v14.66,13.59
  Bottom 0.254: UC1.5 26.1,14.75 26.73,14.13 26.73,13.23 27.53,12.42 v27.53,11.66 | v14.66,13.59 11.39,16.87 10.8,16.87 | 10.8,16.87 Q1.2 | 10.8,16.87 8.03,16.89 C7.2
N$8  (via drill 0.4)
  Top 0.254: v28.29,12.31 28.05,12.55 25.59,12.55 24.55,13.6 v16,13.6
  Bottom 0.254: v28.29,12.31 27.18,13.42 27.18,14.32 26.59,14.91 UC1.6 | Q1.1 10.75,7.45 | 10.75,7.45 11.91,8.6 14.6,8.6 16,10 v16,13.6 | C6.2 9.23,8.97 10.75,7.45
N$9  (via drill 0.4)
  Top 0.254: v29.27,11.25 28.42,11.25 25.63,8.46 17.46,8.46 v16.7,7.7
  Bottom 0.254: v29.27,11.25 31.07,11.25 UC1.19 | v16.7,7.7 13.2,7.7 12.5,7 12.5,4 11.3,2.8 8.3,2.8 7.5,2.8 4.67,2.8 R10.2
N$10  (via drill 0.4)
  Top 0.254: v32.17,13.93 32.17,13.54 32.12,13.48 32.12,11.18 32.9,10.4 39.7,10.4 42.2,7.9 42.2,6.4 43.5,5.1 v44.8,5.1
  Bottom 0.254: R4.2 44.7,2.31 44.7,5 v44.8,5.1 | v32.17,13.93 31.97,13.73 UC1.14
N$11  (via drill 0.4)
  Top 0.254: v32.8,13.2 40.1,13.2 42.2,11.1 v42.2,10.47
  Bottom 0.254: R6.2 43.53,10.7 42.42,10.7 v42.2,10.47 | UC1.15 32.77,13.23 v32.8,13.2
N$12  (via drill 0.4)
  Top 0.254: v33.28,12.32 33.38,12.32 33.8,12.74 39.9,12.74 41.16,11.49 v41.16,10.55
  Bottom 0.254: R7.2 62.88,2.02 59.7,5.2 49.68,5.2 43.72,11.16 41.76,11.16 v41.16,10.55 | UC1.16 32.3,12.73 32.81,12.22 33.18,12.22 v33.28,12.32
N$13  (via drill 0.4)
  Top 0.254: v40.45,11.21 39.38,12.29 34.49,12.29 v33.5,11.3
  Bottom 0.254: R8.2 68.93,5.66 49.87,5.66 43.91,11.61 40.86,11.61 v40.45,11.21 | UC1.17 32.1,12.23 33.03,11.3 v33.5,11.3
N$14
  Bottom 0.254: Q2.B 79.8,7.78 79.8,2.4 80.11,2.09 R15.2
N$15  (via drill 0.4)
  Top 0.254: v95.5,20.61 91.79,20.61 v90.3,22.1
  Bottom 0.254: 83.86,23.6 C19.2 85.87,23.63 86.2,23.3 88.28,23.3 | 88.28,23.3 IC5.6 90.25,22.14 v90.3,22.1 | 88.28,23.3 IC5.7 | v95.5,20.61 96,20.61 97.11,19.5 97.2,19.5 R26.2
N$16
  Bottom 0.254: SW6.L1 2.16,23.86 R23.1
N$17
  Bottom 0.254: R10.1 2.23,4.82 SW4.L1
N$18
  Bottom 0.254: LED1.A 25.34,3.11 R2.1
N$19  (via drill 0.4)
  Top 0.254: v23.6,2.5 26.4,2.5 27.4,3.5 27.4,5.38 29.3,7.28 v29.3,10.1
  Bottom 0.254: R2.2 23.64,2.46 v23.6,2.5 | UC1.21 29.3,10.23 v29.3,10.1
N$20
  Bottom 0.254: C20.1 R24.1 84,20.88 IC5.5
N$21  (via drill 0.4)
  Top 0.254: v80.3,25.4 78.44,27.26 54.86,27.26 50.31,22.71 v50.31,19.59
  Bottom 0.254: R24.2 C19.1 82.07,23.63 v80.3,25.4 | R22.1 50.12,19.4 v50.31,19.59
N$22
  Bottom 0.254: R20.1 96.94,1.67 J3.P3
N$23  (via drill 0.6)
  Top 0.508: 59.3,6.9 D1.A 57.73,6.93 v57.7,6.9
  Bottom 0.508: POWER!.10 57.7,7.31 v57.7,6.9
  Bottom 0.813: POWER!.9 POWER!.10
N$24
  Bottom 0.254: R31.1 95.44,26.81 J4.P3
N$25  (via drill 0.6)
  Top 0.508: v64.6,20.1 64.17,19.67 D2.C
  Bottom 0.508: v64.6,20.1 63.95,19.45 POWER!.1
  Bottom 0.813: POWER!.1 POWER!.2
N$42
  Bottom 0.254: IC4.6 IC4.7 85.53,6.38 85,6.9 85,8.4 83.44,9.96 C14.2 83.44,11.44 85.4,13.4 86.9,13.4 87,13.3 | 87,13.3 87.7,12.6 | R17.2 90.57,12.2 88.1,12.2 87,13.3
N$43
  Bottom 0.254: R14.1 C15.1 84.54,4.76 85.47,3.83 IC4.5
N$45  (via drill 0.4)
  Top 0.254: v42.4,4.21 43.61,3.01 80.46,3.01 v80.6,3.14
  Bottom 0.254: R14.2 81.74,7.84 | R12.1 43.38,3.23 v42.4,4.21 | R14.2 80.6,6.66 v80.6,3.14 | R14.2 81.76,10.41 C14.1
N$57
  Bottom 0.254: R27.1 85.66,26.36 J2.P3
N$66
  Bottom 0.254: R27.2 78.76,26.36 77.63,25.23 Q3.B
POT_1  (via drill 0.4)
  Top 0.254: R1.P$2 17.5,14.9 18.2,14.2 v29.4,14.2
  Bottom 0.254: v29.4,14.2 29.43,14.23 UC1.13
POT_2
  Bottom 0.254: R5.P$2 35.02,16.88 34.22,17.68 30.61,17.68 29.59,16.65 UC1.12
POT_3  (via drill 0.4)
  Top 0.254: 32.73,19.6 v32.7,19.57 33.8,19.57 36.98,19.57 40.79,15.76 41.5,15.76 42.54,15.76 v44,14.3
  Bottom 0.254: R11.P$2 50.75,14.3 v44,14.3 | v32.7,19.57 31.27,18.13 30.42,18.13 29.09,16.8 UC1.11
POT_4  (via drill 0.4)
  Top 0.254: R21.P$2 70,17.85 66.85,21.01 v59.99,21.01 | v51.46,21.56 51.46,19.21 51.11,18.86 46.16,18.86 44.6,17.3 41.04,17.3 37.2,21.13 36.1,21.13 35.32,20.35 32.05,20.35 v31.2,19.5
  Bottom 0.254: v59.99,21.01 v59.98,21 52.02,21 v51.46,21.56 | UC1.10 28.59,17.14 30.95,19.5 v31.2,19.5
RESET  (via drill 0.4)
  Top 0.254: v36.3,25 35.4,25.9 31.7,25.9 31.15,25.35 JP2.10
  Bottom 0.254: 36.74,23.64 R3.1 36.27,24.97 v36.3,25 36.9,25.6 RESET.2 | JP2.10 28.7,25.16 28.7,24 27.09,22.39 UC1.7
SW_DUAL  (via drill 0.4)
  Top 0.254: SW2.4 SW2.3 33.56,1.74 32.2,3.1 32.2,10.2 28.93,13.47 26.19,13.47 v25.99,13.27
  Bottom 0.254: UC1.3 25.09,14.67 25.26,14.5 25.26,14 v25.99,13.27
SW_MODE  (via drill 0.4)
  Top 0.254: SW1.4 SW1.3 15.7,3.19 15.7,7.99 16.72,9.01 25.53,9.01 25.99,9.47 v25.99,10.31
  Bottom 0.254: UC1.2 24.59,14.52 24.8,14.31 24.8,11.59 25.99,10.4 v25.99,10.31
SW_TRIG_1  (via drill 0.4)
  Top 0.254: v21.1,10.2 16.5,10.2 10.2,16.5 10.2,23.4 8.06,25.54 SW6.P$2
  Bottom 0.254: SW6.P$2 SW6.P$1 | UC1.40 21.13,10.23 v21.1,10.2
SW_TRIG_2  (via drill 0.4)
  Top 0.254: SW4.P$1 SW4.P$2 9.46,6.54 11.6,4.4 v14.9,4.4 | v27.18,6.12 27.18,6.26 25.9,7.54 19.11,7.54 17.6,6.04 v17.6,5.6
  Bottom 0.254: v17.6,5.6 17.5,5.6 16.3,4.4 v14.9,4.4 | v27.18,6.12 27.59,6.53 UC1.29
TRIG_1  (via drill 0.4)
  Top 0.254: v77.2,2.2 76.85,2.55 42.85,2.55 v41.3,4.1
  Bottom 0.254: R28.1 77.7,20.08 Q3.C 75.66,20.96 74.8,20.1 74.8,7.1 77.2,4.7 v77.2,2.2 | UC1.33 25.59,6.47 27.28,4.78 27.28,3.42 28.2,2.5 30.71,2.5 31.4,3.19 33.28,3.19 33.58,3.49 40.69,3.49 v41.3,4.1
TRIG_2  (via drill 0.4)
  Top 0.254: v78.63,1.52 77.49,1.52 77.48,1.52 76.28,1.52 75.71,2.09 42.31,2.09 41.2,3.2 33.86,3.2 32.66,4.4 32.66,9.36 v33,9.7
  Bottom 0.254: 77.68,13.58 R16.1 77.68,11.15 Q2.C 77,10.34 76.18,9.52 76.18,6.37 77.66,4.89 77.66,3.02 78.28,2.4 78.28,1.87 v78.63,1.52 | v33,9.7 32.97,9.73 UC1.22
VCC  (via drill 0.4)
  Top 0.305: 59.4,10.6 D1.C
  Top 0.406: v89.7,15.6 89.7,20.7 88.6,21.8 v88.6,27.2 | C2.+ 58.48,12.62 IC1.3 | v89.7,13.1 89.9,12.9 v89.9,7.4 89.9,5.2 88.2,3.5 85.6,3.5 85.55,3.45 83.9,5.1 61.9,5.1 60.5,6.5 60.5,9.5 D1.C
  Top 0.508: D1.C 59.27,13.41 C2.+
  Bottom 0.254: 89.54,9.42 C21.1 88.4,8.54 88.4,7.7 | 88,7.7 IC4.8 | C16.1 88.91,26.51 88.28,25.88 IC5.8
  Bottom 0.406: v89.9,7.4 89.61,7.7 88.4,7.7 88,7.7 | v89.7,13.1 v89.7,15.6 | v88.6,27.2 89.23,27.2 C16.1
VEE  (via drill 0.4)
  Top 0.406: v67.5,18.7 66.8,18.7 64.17,16.07 D2.A 65.91,14.83 66.7,14.04 v91,14.04 93.4,11.64 v93.4,1.4
  Top 0.508: D2.A 64.17,11.48 C1.-
  Bottom 0.406: v67.5,18.7 68.93,18.7 R25.1 | v91,14.04 91,17.2 91.67,17.87 C18.2 91.6,19.18 91.6,20.3 92.17,20.88 IC5.4 | v93.4,1.4 93.37,1.43 C24.2 93.25,3.11 IC4.4

### Text on the board
bPlace: CC-BY-SA 4.0 | Apex v1.0 | Apex By: / Shay Shezifi (PLUM) | file: Apex2.brd | Based on Peaks By: / Olivier Gillet